# EAGLE design Precharge_Board (EAGLE 5.12)
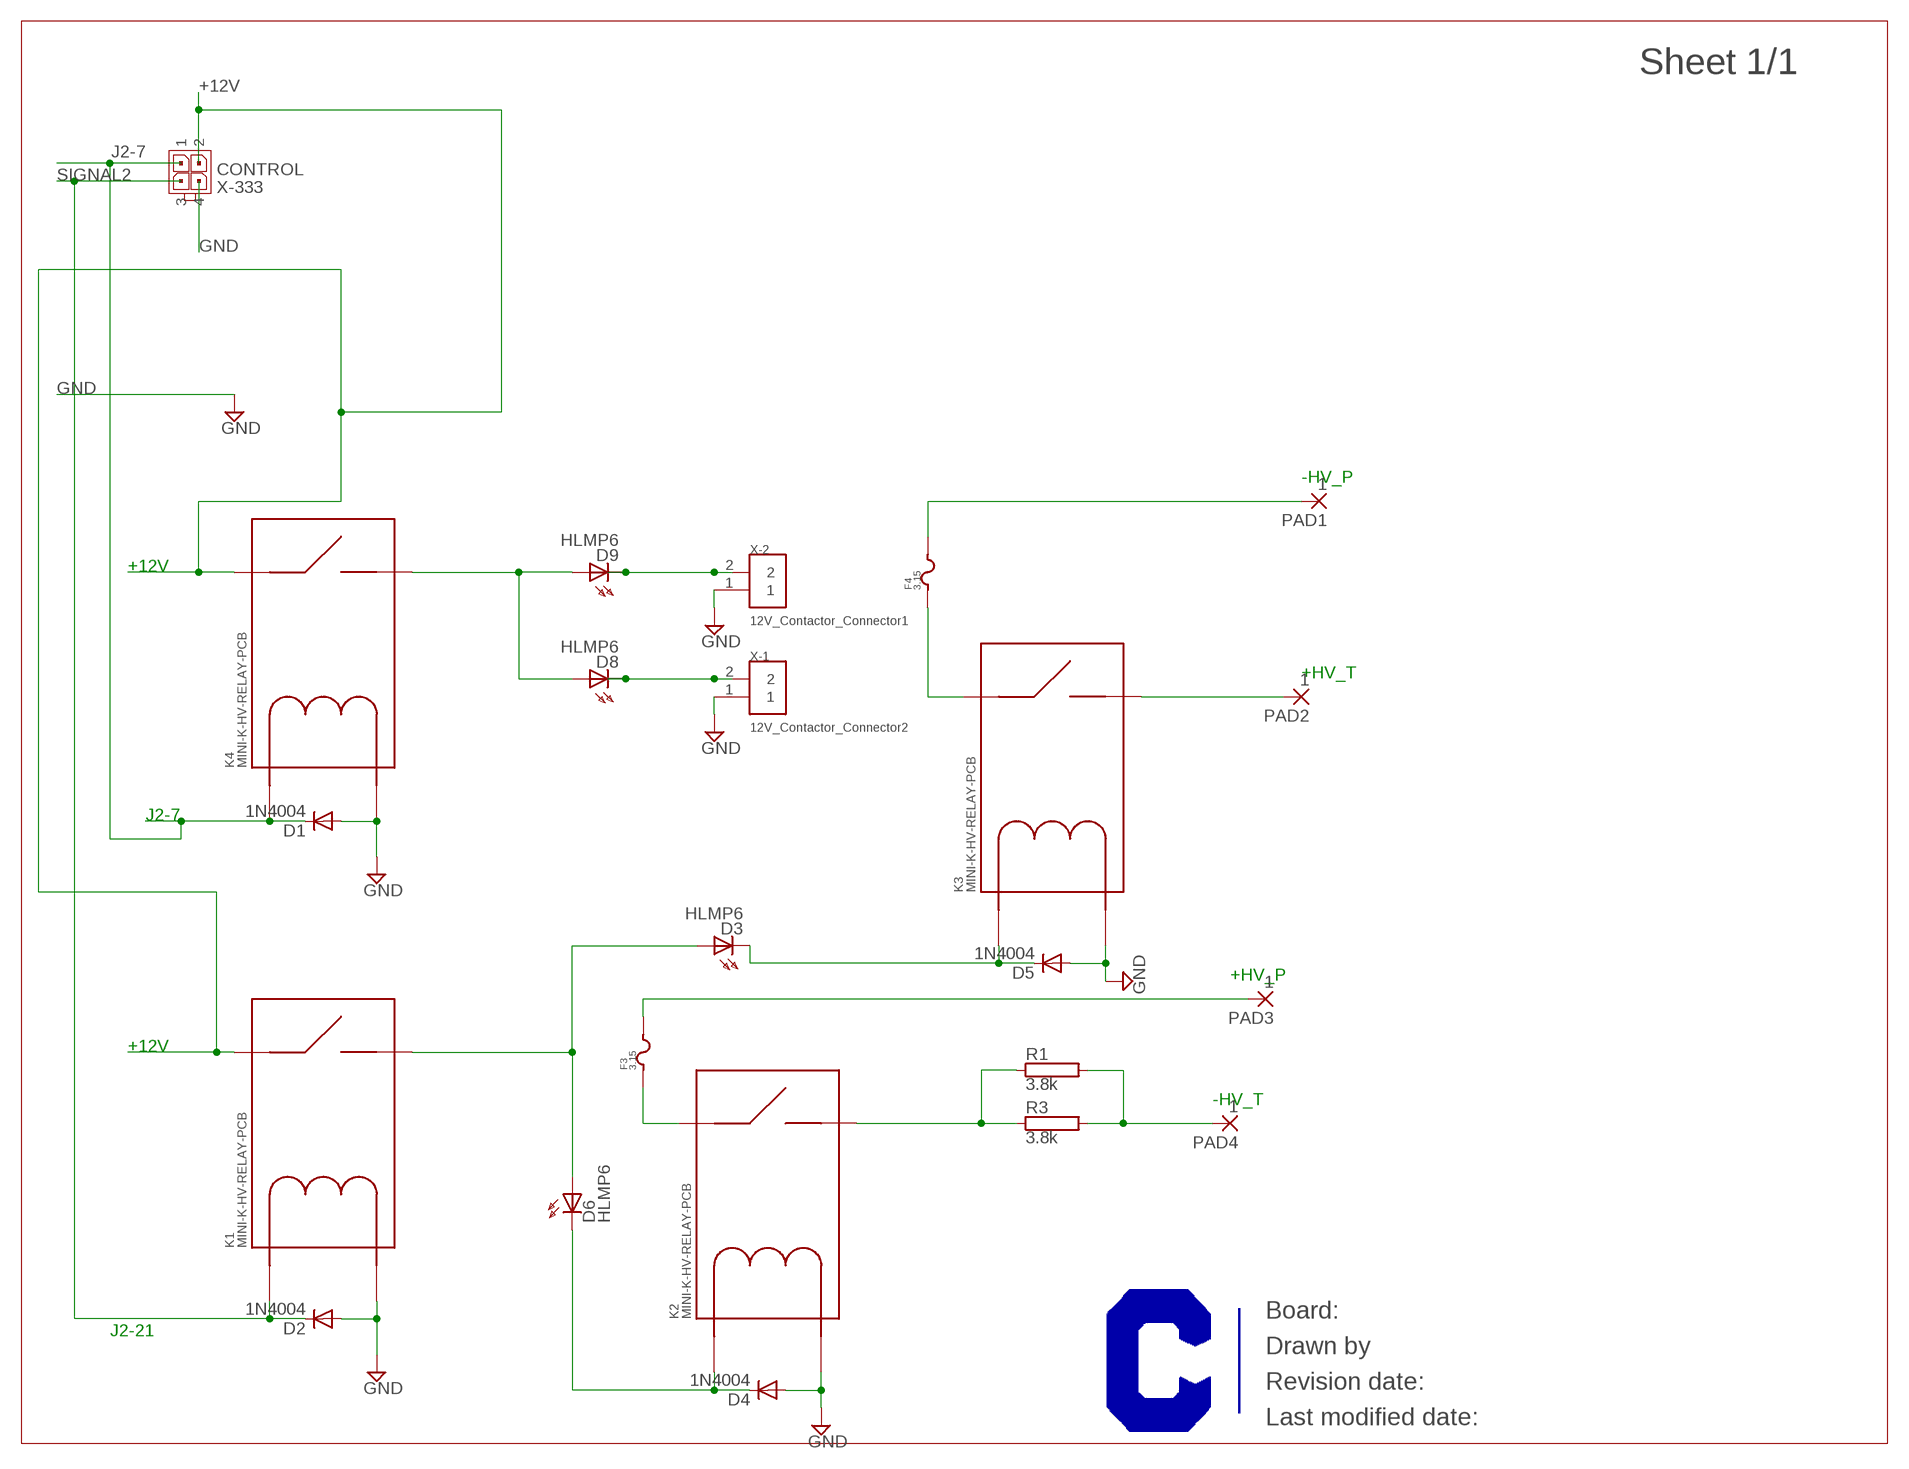
[diagram p0: schematic, sheet 1]

## Parts
D1  1N4004  [DO41-10]
D2  1N4004  [DO41-10]
D3  HLMP6  [HLMP6]
D4  1N4004  [DO41-10]
D5  1N4004  [DO41-10]
D6  HLMP6  [HLMP6]
D8  HLMP6  [HLMP6]
D9  HLMP6  [HLMP6]
F3  3.15  FUSE-1206  [1206]
F4  3.15  FUSE-1206  [1206]
K1  MINI-K-HV-RELAY-PCB  [MINI-K-RELAY_V23700C_PCB]
K2  MINI-K-HV-RELAY-PCB  [MINI-K-RELAY_V23700C_PCB]
K3  MINI-K-HV-RELAY-PCB  [MINI-K-RELAY_V23700C_PCB]
K4  MINI-K-HV-RELAY-PCB  [MINI-K-RELAY_V23700C_PCB]
PAD1  1  2,54/1,0  [2,54/1,0]
PAD2  1  2,54/1,0  [2,54/1,0]
PAD3  1  2,54/1,0  [2,54/1,0]
PAD4  1  2,54/1,0  [2,54/1,0]
R1  3.8k  RMG100-V  [TO-247-2V]
R3  3.8k  RMG100-V  [TO-247-2V]
U$1  CURRENT-C-LETTER-LANDSCAPE  [BLANK]
X-1  12V_Contactor_Connector2  DURACLIK02  [DURACLIK-02]
X-2  12V_Contactor_Connector1  DURACLIK02  [DURACLIK-02]
X-333  CONTROL  MICROFIT-04-DUAL-RA-SMD-CLIP_RETENTION  [MICROFIT-4-DUAL-RA-SMD-CLIP_RETENTION]

## Nets
+12V: K1.5 K4.5 X-333.2
+HV_P: F3.2 PAD3.1(P)
+HV_T: K3.7 PAD2.1(P)
-HV_P: F4.2 PAD1.1(P)
-HV_T: PAD4.1(P) R1.2 R3.2
GND: D1.A D2.A D4.A D5.A K1.2(COIL-) K2.2(COIL-) K3.2(COIL-) K4.2(COIL-) X-1.1 X-2.1 X-333.4
J2-7: D1.C K4.1(COIL+) X-333.1
N$1: F3.1 K2.5
N$3: D3.A D6.A K1.7
N$4: K2.7 R1.1 R3.1
N$5: D8.A D9.A K4.7
N$6: D9.K X-2.2
N$7: D3.K D5.C K3.1(COIL+)
N$8: D8.K X-1.2
N$10: D4.C D6.K K2.1(COIL+)
N$11: F4.1 K3.5
SIGNAL2: D2.C K1.1(COIL+) X-333.3

## Notes on the sheet
- -HV_P
- +12V
- +HV_T
- J2-7
- +HV_P
- +12V
- -HV_T
- J2-21

## Library data of the parts
D1 D2 D4 D5 = diode:1N4004: DIODE general purpose rectifier, 1 A
D3 D6 D8 D9 = display-hp:HLMP6: LED 2mm horizontal; MF: AGILENT TECHNOLOGIES; MPN: HLMP-6500; OC_FARNELL: 1652490; OC_NEWARK: 40K0088
F3 F4 = Fuses_JOHN:FUSE
K1-K4 = TE-Aaron:MINI-K-HV-RELAY: TE Mini K HV Relay; PARTNO: V23700-C0001-A408
PAD1-PAD4 = wirepad:2,54/1,0: THROUGH-HOLE PAD
R1 R3 = JOHN:RMG100: TO-247 Power Resistor - RMG 100 Series Source: www.token.com.tw .. power-resistor-rmg100pdf; OC_FARNELL: unknown; OC_NEWARK: unknown
U$1 = Frames:CURRENT-C-LETTER-LANDSCAPE; BOM: EXCLUDE
X-1 X-2 = BMC components:DURACLIK
X-333 = Molex:MICROFIT-04-DUAL: Molex MicroFit 3.00mm Pitch Header, Surface Mount, Dual Row, 4 Circuits Molex P/N: 43045-0609 (vert) Drawing: http://www.molex.com/pdm_docs/sd/430450418_sd.pdf (vert) Information: http://www.molex.com/molex/products/datasheet.jsp?part=active/0430450418_PCB_HEADERS.xml (vert)

## Board
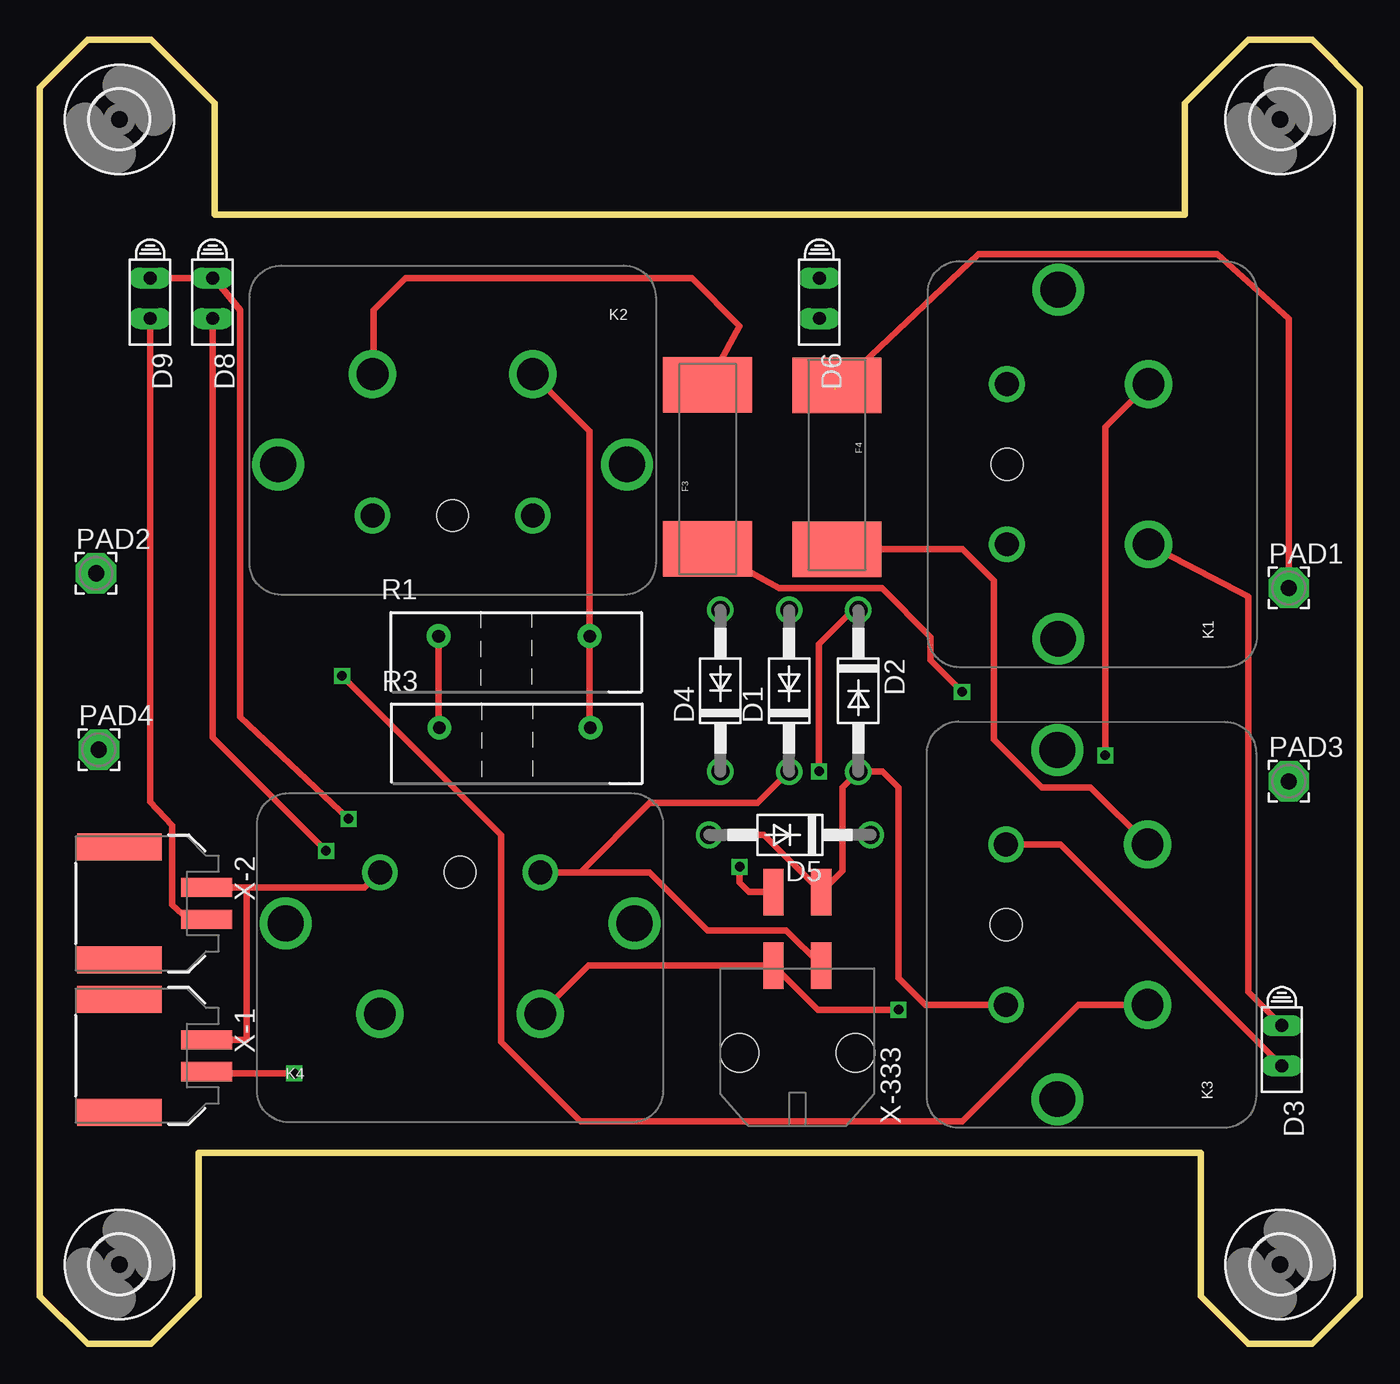
[diagram p1: board, top side]
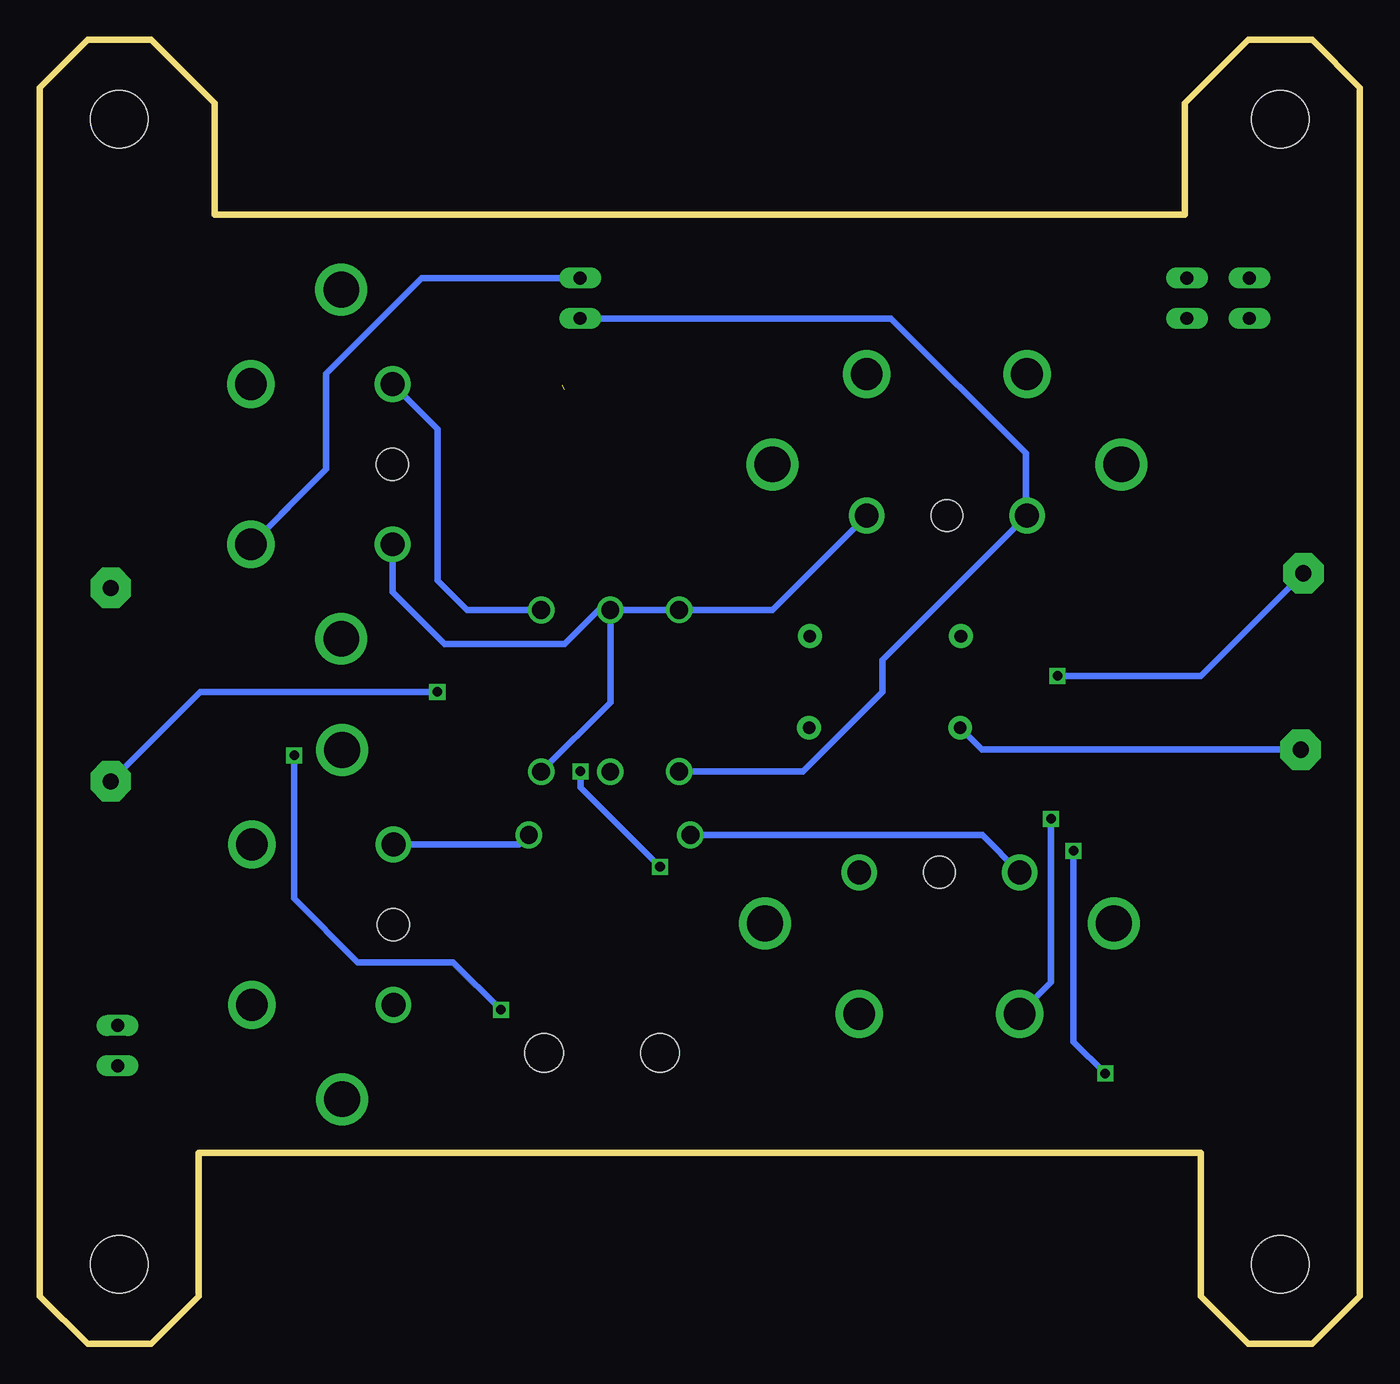
[diagram p2: board, bottom side, seen from below]

Size 83 x 82 mm. Coordinates in mm from the lower left corner, seen from the top.
Outline: 0,79 3,82 7,82 11,78 11,71 72,71 72,78 76,82 80,82 83,79 83,3 80,0 76,0 73,3 73,12 10,12 10,3 7,0 3,0 0,3 0,79
Copper layers (1*16): Top 0.035mm / dielectric 1.5mm / Bottom 0.035mm
Design rules "default *": minimum track width 10mil, minimum drill 13mil, track to track 8mil, track to pad 8mil, pad to pad 8mil, via to via 8mil, smd to smd 8mil, copper to edge 40mil, drill to drill 8mil, minimum pad ring 10mil, minimum via ring 8mil, stop-mask expansion 4mil, vias tented up to drill 0mil, thermal gap 10mil

### Footprints (pad centres in the part's own frame; a part is rotated, then mirrored left to right if it is on the bottom)
DO41-10 = drill 1.118 round: A 5.08,0; C -5.08,0
HLMP6 = drill 0.813 long: A -1.27,0; K 1.27,0
1206 = smd 3.5 x 5.6: 1 10.3,0; 2 0,0
MINI-K-RELAY_V23700C_PCB = drill 1.5 round: 1 5.04,0; 2 -5.04,0 | drill 2 round: 5 5.04,-8.9; 7 -5.04,-8.9 | drill 2.25 round: 8A -10.975,-3.22; 8B 10.975,-3.22 | hole 2: 0,0
2,54/1,0 = drill 1.016 pad 2.54 octagon: 1 0,0
TO-247-2V = drill 0.8 pad 1.5 round: 1 5.5,1.5; 2 -4,1.5
3,6 = hole 3.6: 0,0
DURACLIK-02 = smd 1.2 x 3.2: 1 -1,8.23; 2 1,8.23 | smd 1.7 x 5.3: P$3 -3.55,2.75; P$4 3.55,2.75
MICROFIT-4-DUAL-RA-SMD-CLIP_RETENTION = smd 1.27 x 2.921: 1 1.5,5.47; 2 -1.5,5.47; 3 -1.5,10.1; 4 1.5,10.1 | hole 2.413: 3.65,0; -3.65,0

### Placement (x,y rotation side)
D1  47.12,41.06 90 top
D2  51.47,41.06 270 top
D3  78.1,18.75 270 top
D4  42.8,41.07 90 top
D5  47.17,32 180 top
D6  49.02,65.75 270 top
D8  10.86,65.75 270 top
D9  6.94,65.75 270 top
F3  42,50 90 top
F4  50.12,60.27 270 top
K1  60.82,55.31 90 top
K2  25.96,52.08 180 top
K3  60.76,26.36 90 top
K4  26.43,29.65 0 top
PAD1  78.54,47.53 0 top
PAD2  3.54,48.45 0 top
PAD3  78.54,35.37 0 top
PAD4  3.71,37.36 0 top
R1  29.08,43 0 top
R3  29.12,37.24 0 top
U$1  -27.94,93.01 0 top  (outside the outline)
U$2  [3,6]  78,77 0 top
U$3  [3,6]  5,77 0 top
U$4  [3,6]  5,5 0 top
U$5  [3,6]  78,5 0 top
X-1  2.26,18.12 270 top
X-2  2.26,27.69 270 top
X-333  47.64,18.31 0 top

### Tracks (layer width: path | path; a pad name or v marks a point on that pad's centre or on a via)
+12V  (via drill 0.6)
  Top 0.406: K4.5 34.5,23.78 X-333.2 48.92,21 v54,21 | K1.5 67,57.63 v67,37
  Bottom 0.406: v67,37 67,28 63,24 57,24 v54,21
+HV_P  (via drill 0.6)
  Top 0.406: F3.2 46.49,47.51 52.94,47.51 56,44.45 56,43 v58,41
  Bottom 0.406: PAD3.1 72.91,41 v58,41
+HV_T  (via drill 0.6)
  Top 0.406: K3.7 65.32,21.32 58,14 34,14 29,19 29,32 v19,42
  Bottom 0.406: v19,42 9.99,42 PAD2.1
-HV_P  (1 unrouted)
  Top 0.406: PAD1.1 78.54,64.46 74.03,68.52 59.03,68.52 50,60
-HV_T
  Top 0.406: R3.2 25.08,38.78 R1.2
  Bottom 0.406: PAD4.1 23.74,37.36 R3.2
GND
  Top 0.406: K4.2 20.43,28.69 13,28.69 | 13,28.69 X-2.1 | X-1.1 13,19.12 13,28.69 | K3.2 55.68,21.32 54,23 54,35 53,36 51.49,36 D2.A 50.47,34.98 50.47,29.74 X-333.4 45.55,32 D5.A
  Bottom 0.406: D1.A D4.A 36.93,46.15 K2.2 | K4.2 23.74,32 D5.A | D1.A 47.12,40.33 D2.A | D1.A 47.86,46.14 50,44 57.55,44 60.82,47.27 K1.2
J2-7
  Top 0.406: X-333.1 46.92,26 42,26 38.35,29.65 34,29.65 | K4.1 34,29.65 | D1.C 45.14,34 38.35,34 34,29.65
N$1
  Top 0.406: F3.1 44,64 41,67 23,67 21,65 21,61.06 K2.5
N$3
  Top 0.406: K1.7 76,46.99 76,22.12 D3.A
  Bottom 0.406: 66,53.99 K1.7 65,54.99 65,61 58.98,67.02 D6.A
N$4
  Top 0.406: R3.1 34.58,38.78 R1.1 34.58,57.4 K2.7
N$5  (via drill 0.6)
  Top 0.406: v19.42,33.01 12.59,39.42 12.59,65 10.98,67.02 D8.A D9.A
  Bottom 0.406: K4.7 19.42,22.72 v19.42,33.01
N$6
  Top 0.406: D9.K 6.94,34.06 8.33,32.59 8.33,27.59 9,27 10.18,27 X-2.2
N$7
  Top 0.406: D3.K 64.18,31.4 K3.1
  Bottom 0.406: D5.C 52.85,31.4 K3.1
N$8  (via drill 0.6)
  Top 0.406: D8.K 10.86,38.14 v18,31 | v16,17 10.61,17 X-1.2
  Bottom 0.406: v18,31 18,19 v16,17
N$10
  Bottom 0.406: D4.C 35.01,35.99 30,41 30,43 K2.1 21,52.16 21,56 29.48,64.48 D6.K
N$11
  Top 0.406: K3.5 66.06,35 63,35 60,38 60,48 58.03,49.97 F4.1
SIGNAL2  (via drill 0.6)
  Top 0.406: D2.C 51.14,46.14 49,44 v49,36 | v44,30 44,29 44.59,28.41 X-333.3
  Bottom 0.406: D2.C 56.14,46.14 58,48 58,57.53 K1.1 | v49,36 49,35 v44,30